# Altium schematic sheet Sheet1.SchDoc
size A3
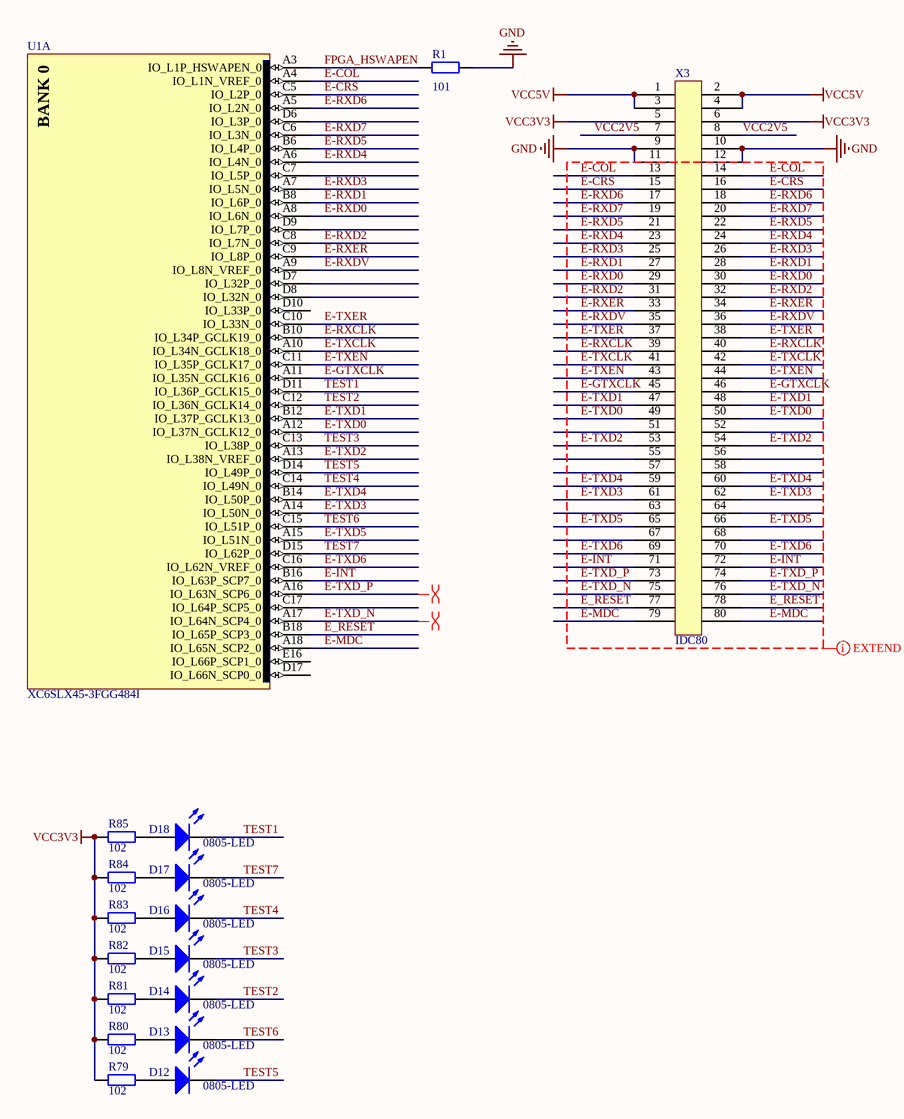
[diagram p0: Sheet1.SchDoc]

## Parts
D12  0805-LED  [0805LED]
D13  0805-LED  [0805LED]
D14  0805-LED  [0805LED]
D15  0805-LED  [0805LED]
D16  0805-LED  [0805LED]
D17  0805-LED  [0805LED]
D18  0805-LED  [0805LED]
R1  101  [0603]
R79  102  [0603]
R80  102  [0603]
R81  102  [0603]
R82  102  [0603]
R83  102  [0603]
R84  102  [0603]
R85  102  [0603]
U1  XC6SLX45-3FGG484I  [FGG484]  (part A of 8)
X3  IDC80  [SDC80_1.27MM_MALE]

## Nets
GND: R1.1 X3.9 X3.10 X3.11 X3.12
VCC3V3: R79.1 R80.1 R81.1 R82.1 R83.1 R84.1 R85.1 X3.5 X3.6
VCC5V: X3.1 X3.2 X3.3 X3.4
E-COL: U1.A4(IO_L1N_VREF_0) X3.13 X3.14
E-CRS: U1.C5(IO_L2P_0) X3.15 X3.16
E-GTXCLK: U1.A11(IO_L35N_GCLK16_0) X3.45 X3.46
E-INT: U1.B16(IO_L63P_SCP7_0) X3.71 X3.72
E-MDC: U1.A18(IO_L65N_SCP2_0) X3.79 X3.80
E-RXCLK: U1.B10(IO_L34P_GCLK19_0) X3.39 X3.40
E-RXD0: U1.A8(IO_L6N_0) X3.29 X3.30
E-RXD1: U1.B8(IO_L6P_0) X3.27 X3.28
E-RXD2: U1.C8(IO_L7N_0) X3.31 X3.32
E-RXD3: U1.A7(IO_L5N_0) X3.25 X3.26
E-RXD4: U1.A6(IO_L4N_0) X3.23 X3.24
E-RXD5: U1.B6(IO_L4P_0) X3.21 X3.22
E-RXD6: U1.A5(IO_L2N_0) X3.17 X3.18
E-RXD7: U1.C6(IO_L3N_0) X3.19 X3.20
E-RXDV: U1.A9(IO_L8N_VREF_0) X3.35 X3.36
E-RXER: U1.C9(IO_L8P_0) X3.33 X3.34
E-TXCLK: U1.A10(IO_L34N_GCLK18_0) X3.41 X3.42
E-TXD0: U1.A12(IO_L37N_GCLK12_0) X3.49 X3.50
E-TXD1: U1.B12(IO_L37P_GCLK13_0) X3.47 X3.48
E-TXD2: U1.A13(IO_L38N_VREF_0) X3.53 X3.54
E-TXD3: U1.A14(IO_L50N_0) X3.61 X3.62
E-TXD4: U1.B14(IO_L50P_0) X3.59 X3.60
E-TXD5: U1.A15(IO_L51N_0) X3.65 X3.66
E-TXD6: U1.C16(IO_L62N_VREF_0) X3.69 X3.70
E-TXD_N: U1.A17(IO_L64N_SCP4_0) X3.75 X3.76
E-TXD_P: U1.A16(IO_L63N_SCP6_0) X3.73 X3.74
E-TXEN: U1.C11(IO_L35P_GCLK17_0) X3.43 X3.44
E-TXER: U1.C10(IO_L33N_0) X3.37 X3.38
E_RESET: U1.B18(IO_L65P_SCP3_0) X3.77 X3.78
FPGA_HSWAPEN: R1.2 U1.A3(IO_L1P_HSWAPEN_0)
TEST1: D18.2(K) U1.D11(IO_L36P_GCLK15_0)
TEST2: D14.2(K) U1.C12(IO_L36N_GCLK14_0)
TEST3: D15.2(K) U1.C13(IO_L38P_0)
TEST4: D16.2(K) U1.C14(IO_L49N_0)
TEST5: D12.2(K) U1.D14(IO_L49P_0)
TEST6: D13.2(K) U1.C15(IO_L51P_0)
TEST7: D17.2(K) U1.D15(IO_L62P_0)
VCC2V5: X3.7 X3.8
NetD12_1: D12.1(A) R79.2
NetD13_1: D13.1(A) R80.2
NetD14_1: D14.1(A) R81.2
NetD15_1: D15.1(A) R82.2
NetD16_1: D16.1(A) R83.2
NetD17_1: D17.1(A) R84.2
NetD18_1: D18.1(A) R85.2

Not connected (* = marked no-connect by the designer): U1 C7(IO_L5P_0) C17(IO_L64P_SCP5_0) D6(IO_L3P_0) D7(IO_L32P_0) D8(IO_L32N_0) D9(IO_L7P_0) D10(IO_L33P_0) D17(IO_L66N_SCP0_0) E16(IO_L66P_SCP1_0); X3 51 52 55 56 57 58 63 64 67 68

## Layout directives
net class EXTEND: E-COL, E-CRS, E-GTXCLK, E-INT, E-MDC, E-RXCLK, E-RXD0, E-RXD1, E-RXD2, E-RXD3, E-RXD4, E-RXD5, E-RXD6, E-RXD7, E-RXDV, E-RXER, E-TXCLK, E-TXD0, E-TXD1, E-TXD2, E-TXD3, E-TXD4, E-TXD5, E-TXD6, E-TXD_N, E-TXD_P, E-TXEN, E-TXER, E_RESET
differential pair: E-TXD_N, E-TXD_P

## Notes on the sheet
- (in symbol XC6SLX45-3FGG484I, part A) BANK 0

## Library data of the parts
D12-D18 = LED0: Typical INFRARED GaAs LED; Published: 8-Jun-2000; LatestRevisionDate: 08-Jul-2005; LatestRevisionNote: Mech Layer 1 removed.; PackageReference: LED-0; Publisher: Altium Limited
R1 = Res2: Resistor; Value: 100R; Published: 8-Jun-2000; LatestRevisionDate: 17-Jul-2002; LatestRevisionNote: Re-released for DXP Platform.; PackageReference: AXIAL-0.4; Publisher: Altium Limited
R79-R85 = Res2: Resistor; Value: 150R; Published: 8-Jun-2000; LatestRevisionDate: 17-Jul-2002; LatestRevisionNote: Re-released for DXP Platform.; PackageReference: AXIAL-0.4; Publisher: Altium Limited
U1 = XC6SLX45-3FGG484I: Spartan-6 LX 1.2V FPGA, 316 User I/Os, 484-Ball Fine-Pitch BGA (1.0mm Pitch), Speed Grade 3, Industrial Grade, Pb-Free; FirstPublished: 17-Nov-2009; DatasheetVersion: ver1.3, Nov-2009; PackageVersion: ver1.1, Dec-2008; PackageReference: FGG484; Publisher: Altium Limited; PackageDescription: 484-Ball Fine Pitch Ball Grid Array 1.00 mm Pitch (FGG484) - Pb-Free; Code_JEDEC: MS-034-AAJ-1; Code_IPC: BGA100P22X22-484; ComponentLink1Description: Spartan-6 Datasheet; ComponentLink1URL: http://www.xilinx.com/support/documentation/data_sheets/ds160.pdf; ComponentLink2Description: Pinout Specification; ComponentLink2URL: http://www.xilinx.com/support/documentation/user_guides/ug385.pdf; ComponentLink3Description: FGG484 Package Drawing; ComponentLink3URL: http://www.xilinx.com/support/documentation/package_specs/fg484.pdf; ComponentLink4Description: Spartan-6 Documents; ComponentLink4URL: http://www.xilinx.com/support/documentation/spartan-6.htm; ComponentLink5Description: Xilinx.com Home; ComponentLink5URL: http://www.xilinx.com